# EAGLE schematic 7_seg (EAGLE 6.2)
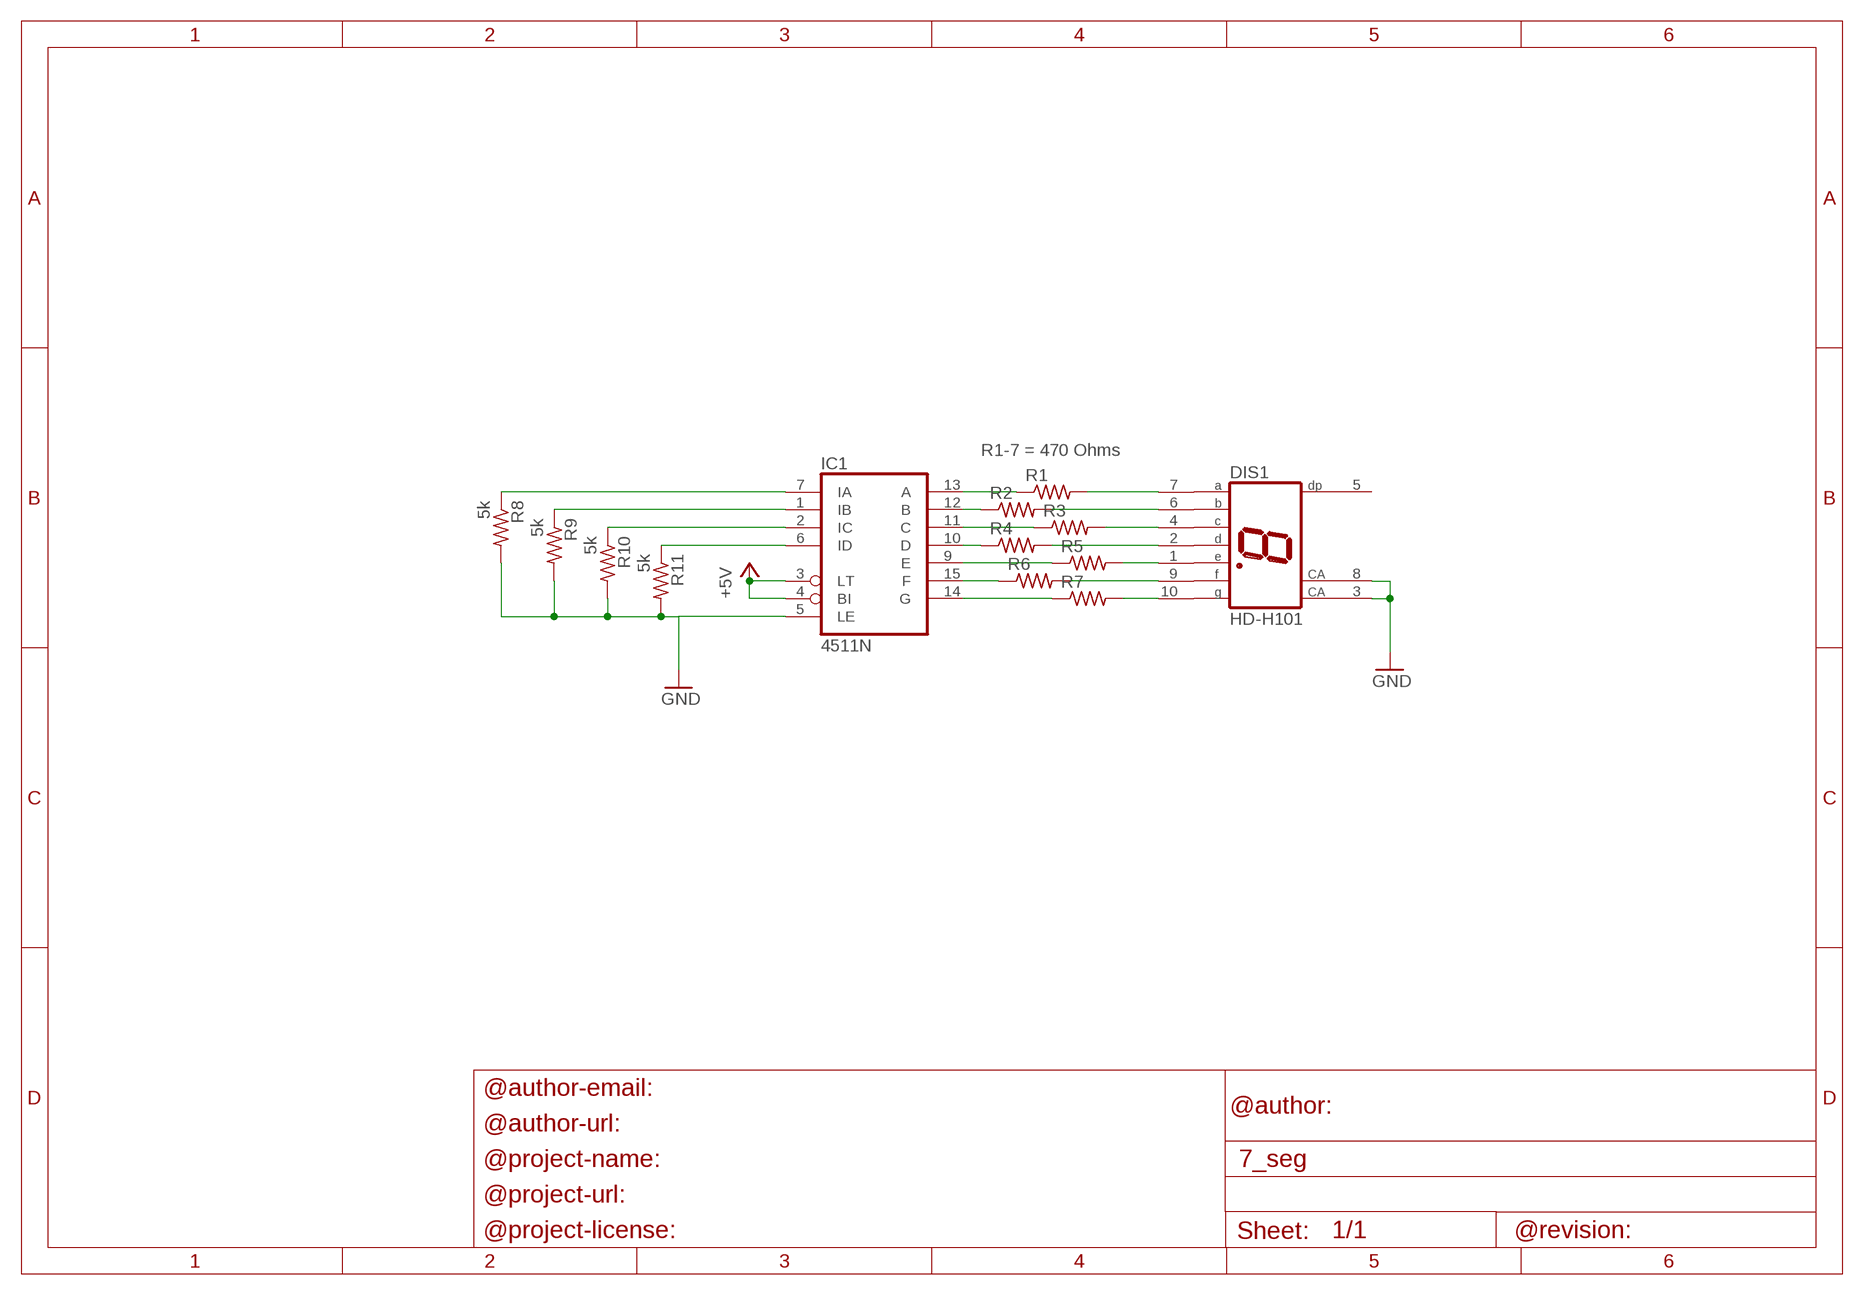
[diagram p0: schematic, sheet 1]

## Parts
DIS1  HD-H101  [HDSP-M]
IC1  4511N  [DIL16]
R1  R-US_0204/7  [0204/7]
R2  R-US_0204/7  [0204/7]
R3  R-US_0204/7  [0204/7]
R4  R-US_0204/7  [0204/7]
R5  R-US_0204/7  [0204/7]
R6  R-US_0204/7  [0204/7]
R7  R-US_0204/7  [0204/7]
R8  5k  R-US_0204/7  [0204/7]
R9  5k  R-US_0204/7  [0204/7]
R10  5k  R-US_0204/7  [0204/7]
R11  5k  R-US_0204/7  [0204/7]

## Nets
+5V: IC1.3(LT) IC1.4(BI)
GND: DIS1.3(CA) DIS1.8(CA) IC1.5(LE) R8.2 R9.2 R10.2 R11.2
N$1: IC1.13(A) R1.1
N$2: IC1.12(B) R2.1
N$3: IC1.11(C) R3.1
N$4: IC1.10(D) R4.1
N$5: IC1.9(E) R5.1
N$6: IC1.15(F) R6.1
N$7: IC1.14(G) R7.1
N$8: DIS1.7(A) R1.2
N$9: DIS1.6(B) R2.2
N$10: DIS1.4(C) R3.2
N$11: DIS1.2(D) R4.2
N$12: DIS1.1(E) R5.2
N$13: DIS1.9(F) R6.2
N$14: DIS1.10(G) R7.2
N$15: IC1.7(IA) R8.1
N$16: IC1.1(IB) R9.1
N$17: IC1.2(IC) R10.1
N$18: IC1.6(ID) R11.1
Unconnected: DIS1.5(DP)

## Notes on the sheet
- R1-7 = 470 Ohms

## Power pins joined to a net without a drawn wire
VDD: IC1.16(VDD)
VSS: IC1.8(VSS)

## Library data of the parts
DIS1 = display-hp:HD-H101: LED DISPLAY 1-character 7 segment, decimal point right; OC_FARNELL: unknown; OC_NEWARK: unknown
IC1 = 45xx:4511: BCD to 7-segment LATCH/DECODER/DRIVER
R1-R11 = resistor:R-US_: RESISTOR, American symbol